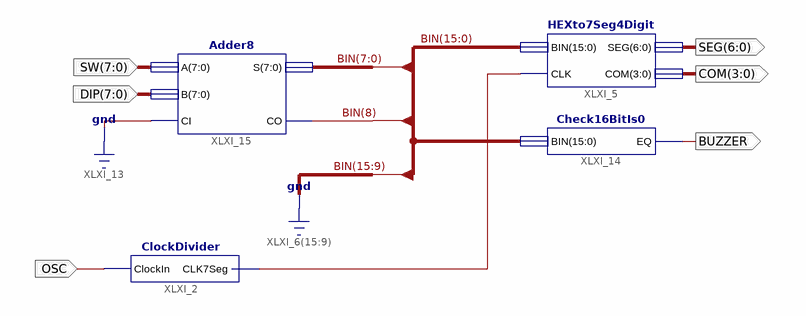
[diagram p0: schematic sheet 1]
// Xilinx ISE schematic Adder.sch (spartan6) as structural Verilog: 4 symbols, 6 ports
module Adder (
  input  OSC,
  input  [7:0] SW,
  input  [7:0] DIP,
  output [6:0] SEG,
  output [3:0] COM,
  output BUZZER
);

  wire XLXN_9;
  wire [8:0] BIN;

  ClockDivider XLXI_2 (.ClockIn(OSC), .CLK7Seg(XLXN_9));
  HEXto7Seg4Digit XLXI_5 (.BIN({{7{1'b0}}, BIN}), .CLK(XLXN_9), .SEG(SEG), .COM(COM));
  Adder8 XLXI_15 (.A(SW), .B(DIP), .CI(1'b0), .S(BIN[7:0]), .CO(BIN[8]));
  Check16BitIs0 XLXI_14 (.BIN({{7{1'b0}}, BIN}), .EQ(BUZZER));
endmodule
